# EAGLE design logger100 (EAGLE 6.4)
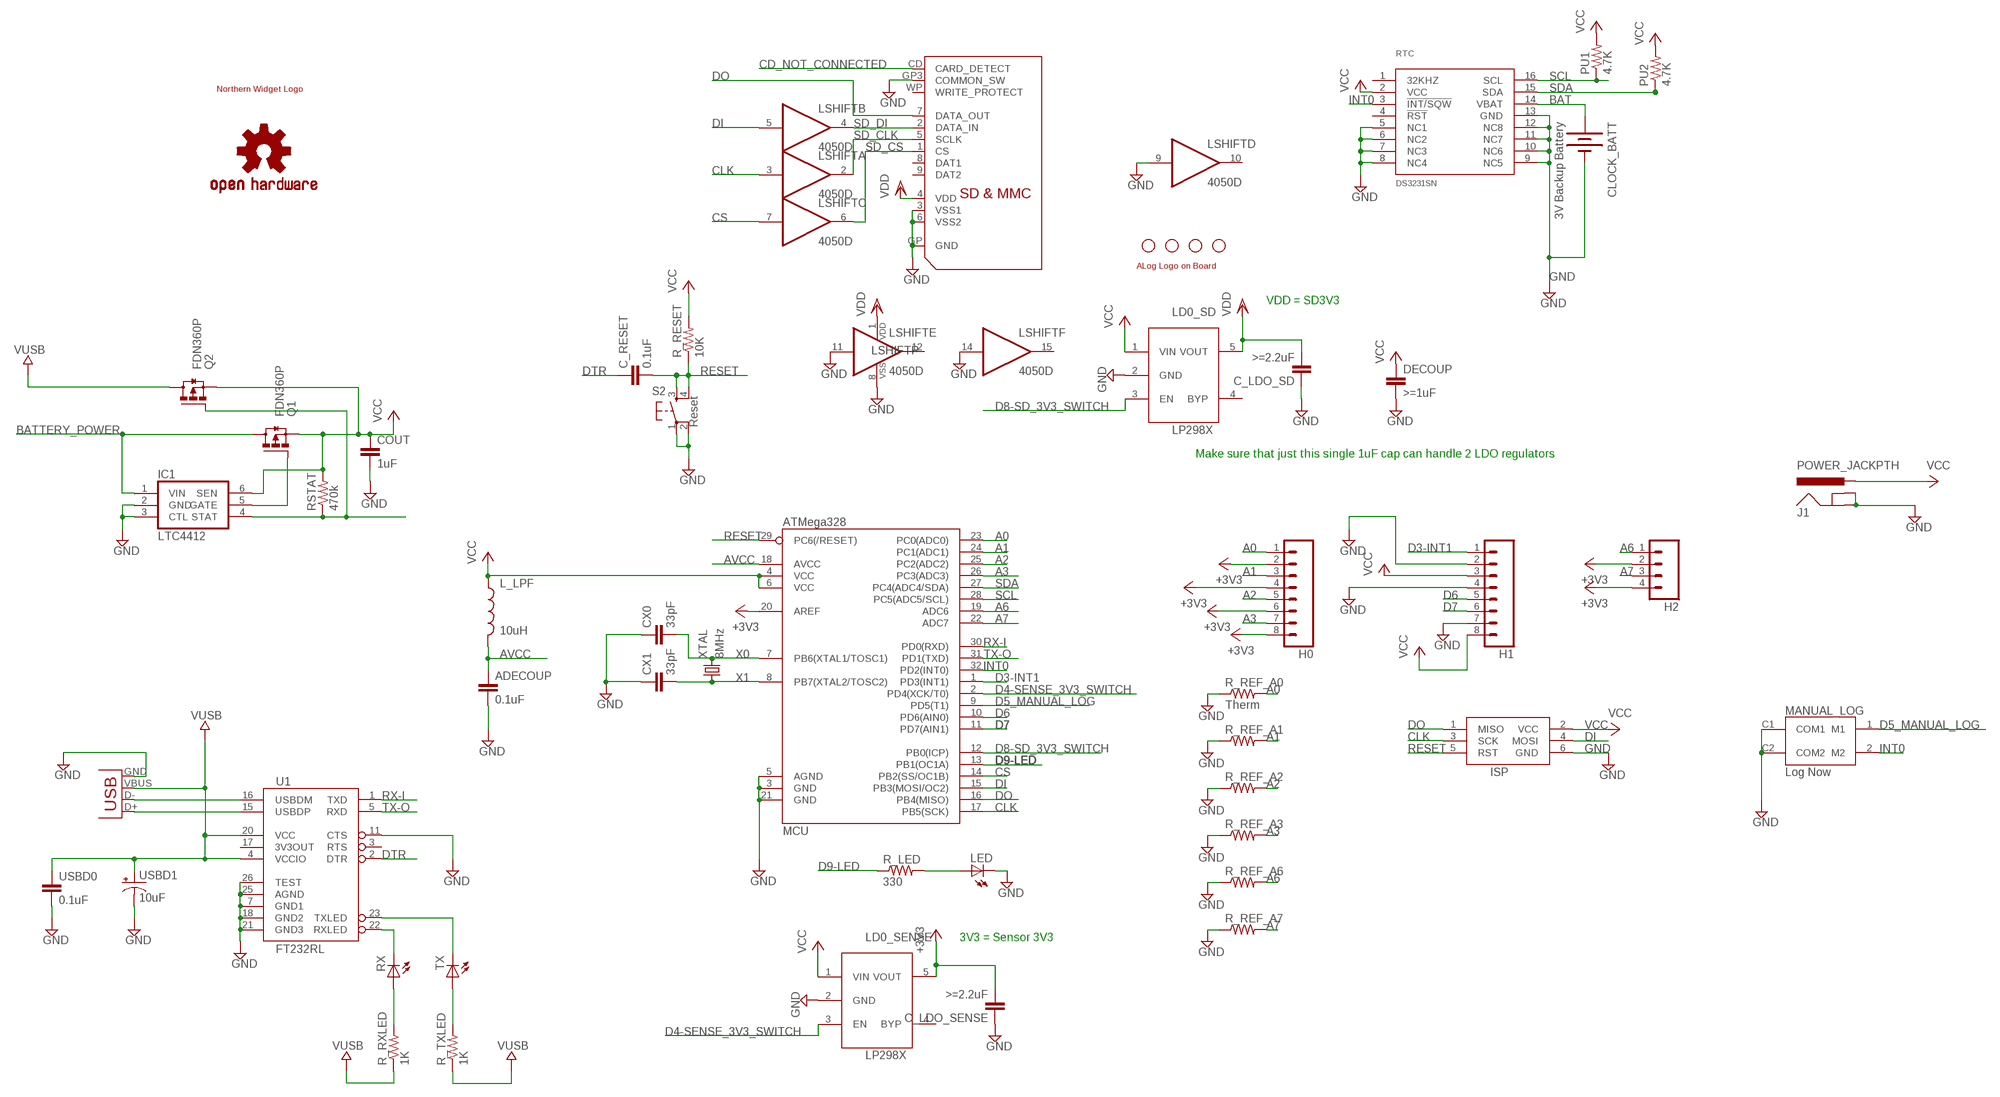
[diagram p0: schematic, sheet 1]

## Parts
ADECOUP  0.1uF  C-EUC0603  [C0603]
C_LDO_SD  >=2.2uF  C-EUC0603  [C0603]
C_LDO_SENSE  >=2.2uF  C-EUC0603  [C0603]
C_RESET  0.1uF  C-EUC0603  [C0603]
CLOCK_BATT  3V Backup Battery  BATTERY12PTH  [BATTCON_12MM_PTH]
COUT  1uF  C-EUC0603  [C0603-ROUND]
CX0  33pF  C-EUC0603  [C0603]
CX1  33pF  C-EUC0603  [C0603]
DECOUP  >=1uF  C-EUC0603  [C0603]
H0  M083.5MM-8  [SCREWTERMINAL-3.5MM-8]
H1  M083.5MM-8  [SCREWTERMINAL-3.5MM-8]
H2  M04SCREW  [SCREWTERMINAL-3.5MM-4]
IC1  LTC4412  LTC4412ES6  [TSOT23-6]
ISP  AVRISP-6  [AVRISP]
J1  POWER_JACKPTH  [POWER_JACK_PTH]
JP1  STAND-OFF  [STAND-OFF]
JP2  STAND-OFF  [STAND-OFF]
JP3  STAND-OFF  [STAND-OFF]
JP4  STAND-OFF  [STAND-OFF]
JP5  USB-B  USBPTH  [USB-B-PTH]
L_LPF  10uH  INDUCTOR0805  [0805]
LD0_SD  LP2985  LP298XS  [SOT23-5L]
LD0_SENSE  LP2985  LP298XS  [SOT23-5L]
LED  LED3MM  [LED3MM]
LOGO1  OSHW-LOGOM  [OSHW-LOGO-M]
LSHIFT  4050D  [SO16]
MANUAL_LOG  Log Now  TL3350'TL3350'  [TL_BUTTON]
MCU  ATMega328  ATMEGA168  [TQFP32-08]
PU1  4.7K  R-US_R0603  [R0603]
PU2  4.7K  R-US_R0603  [R0603]
Q1  FDN360P  [SUPER-SOT3]
Q2  FDN360P  [SUPER-SOT3]
R_LED  330  R-US_R0603  [R0603]
R_REF_A0  Therm  R-US_0207/10  [0207/10]
R_REF_A1  R-US_0207/10  [0207/10]
R_REF_A2  R-US_0207/10  [0207/10]
R_REF_A3  R-US_0207/10  [0207/10]
R_REF_A6  R-US_0207/10  [0207/10]
R_REF_A7  R-US_0207/10  [0207/10]
R_RESET  10K  R-US_R0603  [R0603]
R_RXLED  1K  R-US_R0603  [R0603]
R_TXLED  1K  R-US_R0603  [R0603]
RSTAT  470k  R-US_R0603  [R0603]
RTC  DS3231SN  [SO16W]
RX  LED0603  [LED-0603]
S2  Reset  TAC_SWITCHSND  [TACTILE_SWITCH_SMD]
SD  SDMMC06132  [06132]
TX  LED0603  [LED-0603]
U1  FT232RL  FT232RL-BASICSSOP  [SSOP28DB]
U$1  NWLOGO  [NWLOGO]
U$2  ALOG_LOGO_V1_5.5MM  [ALOG_LOGO_V1_SMALL]
USBD0  0.1uF  C-EUC0603  [C0603]
USBD1  10uF  CAP_POL1206  [EIA3216]
XTAL  8MHz  CRYSTALHC49UV  [HC49U-V]

## Nets
+3V3: C_LDO_SENSE.2 H0.2 H0.4 H0.6 H0.8 H2.2 H2.4 LD0_SENSE.5(VOUT) MCU.20(AREF)
A0: H0.1 MCU.23(PC0(ADC0)) R_REF_A0.2
A1: H0.3 MCU.24(PC1(ADC1)) R_REF_A1.2
A2: H0.5 MCU.25(PC2(ADC2)) R_REF_A2.2
A3: H0.7 MCU.26(PC3(ADC3)) R_REF_A3.2
A6: H2.1 MCU.19(ADC6) R_REF_A6.2
A7: H2.3 MCU.22(ADC7) R_REF_A7.2
AVCC: ADECOUP.1 L_LPF.2 MCU.18(AVCC)
BAT: CLOCK_BATT.VCC@1(+) RTC.14(VBAT)
BATTERY_POWER: IC1.1(VIN) Q1.3(D)
CD_NOT_CONNECTED: SD.CD(CARD_DETECT)
CLK: ISP.3(SCK) LSHIFT.3(A:I) MCU.17(PB5(SCK))
CS: LSHIFT.7(C:I) MCU.14(PB2(SS/OC1B))
D3-INT1: H1.1 MCU.1(PD3(INT1))
D4-SENSE_3V3_SWITCH: LD0_SENSE.3(EN) MCU.2(PD4(XCK/T0))
D5_MANUAL_LOG: MANUAL_LOG.1(M1) MCU.9(PD5(T1))
D6: H1.5 MCU.10(PD6(AIN0))
D7: H1.6 MCU.11(PD7(AIN1))
D8-SD_3V3_SWITCH: LD0_SD.3(EN) MCU.12(PB0(ICP))
D9-LED: MCU.13(PB1(OC1A)) R_LED.1
DI: ISP.4(MOSI) LSHIFT.5(B:I) MCU.15(PB3(MOSI/OC2))
DO: ISP.1(MISO) MCU.16(PB4(MISO)) SD.7(DATA_OUT)
DTR: C_RESET.1 U1.2(DTR)
GND: ADECOUP.2 C_LDO_SD.1 C_LDO_SENSE.1 CLOCK_BATT.GND(-) COUT.2 CX0.1 CX1.1 DECOUP.2 H1.2 H1.4 H1.7 IC1.2(GND) IC1.3(CTL) ISP.6(GND) J1.GND J1.GNDBREAK JP5.GND LD0_SD.2(GND) LD0_SENSE.2(GND) LED.K(C) LSHIFT.8(P:VSS) LSHIFT.9(D:I) LSHIFT.11(E:I) LSHIFT.14(F:I) MANUAL_LOG.C1(COM1) MANUAL_LOG.C2(COM2) MCU.3(GND) MCU.5(AGND) MCU.21(GND) R_REF_A0.1 R_REF_A1.1 R_REF_A2.1 R_REF_A3.1 R_REF_A6.1 R_REF_A7.1 RTC.5(NC1) RTC.6(NC2) RTC.7(NC3) RTC.8(NC4) RTC.9(NC5) RTC.10(NC6) RTC.11(NC7) RTC.12(NC8) RTC.13(GND) S2.1 S2.2 SD.3(VSS1) SD.6(VSS2) SD.GP3(COMMON_SW) SD.GP(GND) U1.7(GND1) U1.11(CTS) U1.18(GND2) U1.21(GND3) U1.25(AGND) U1.26(TEST) USBD0.2 USBD1.C(-)
INT0: MANUAL_LOG.2(M2) MCU.32(PD2(INT0)) RTC.3(!INT/SQW)
LED+: LED.A R_LED.2
N$1: RX.C U1.22(RXLED)
N$2: JP5.D+ U1.15(USBDP)
N$3: JP5.D- U1.16(USBDM)
N$4: TX.C U1.23(TXLED)
N$5: R_RXLED.2 RX.A
N$6: R_TXLED.2 TX.A
N$7: IC1.4(STAT) Q2.1(G) RSTAT.1
N$8: IC1.5(GATE) Q1.1(G)
RESET: C_RESET.2 ISP.5(RST) MCU.29(PC6(/RESET)) R_RESET.1 S2.3 S2.4
RX-I: MCU.30(PD0(RXD)) U1.1(TXD)
SCL: MCU.28(PC5(ADC5/SCL)) PU1.1 RTC.16(SCL)
SD_CLK: LSHIFT.2(A:O) SD.5(SCLK)
SD_CS: LSHIFT.6(C:O) SD.1(CS)
SD_DI: LSHIFT.4(B:O) SD.2(DATA_IN)
SDA: MCU.27(PC4(ADC4/SDA)) PU2.1 RTC.15(SDA)
TX-O: MCU.31(PD1(TXD)) U1.5(RXD)
VCC: COUT.1 DECOUP.1 H1.3 H1.8 IC1.6(SEN) ISP.2(VCC) J1.PWR L_LPF.1 LD0_SD.1(VIN) LD0_SENSE.1(VIN) MCU.4(VCC) MCU.6(VCC) PU1.2 PU2.2 Q1.2(S) Q2.2(S) R_RESET.2 RSTAT.2 RTC.2(VCC)
VDD: C_LDO_SD.2 LD0_SD.5(VOUT) LSHIFT.1(P:VDD) SD.4(VDD)
VUSB: JP5.VBUS Q2.3(D) R_RXLED.1 R_TXLED.1 U1.4(VCCIO) U1.20(VCC) USBD0.1 USBD1.A(+)
X0: CX0.2 MCU.7(PB6(XTAL1/TOSC1)) XTAL.2
X1: CX1.2 MCU.8(PB7(XTAL2/TOSC2)) XTAL.1
Unconnected: LD0_SD.4(BYP) LD0_SENSE.4(BYP) LSHIFT.10(D:O) LSHIFT.12(E:O) LSHIFT.15(F:O) RTC.1(32KHZ) RTC.4(!RST) SD.8(DAT1) SD.9(DAT2) SD.WP(WRITE_PROTECT) U1.3(RTS) U1.17(3V3OUT)

## Notes on the sheet
- VDD = SD3V3
- Make sure that just this single 1uF cap can handle 2 LDO regulators
- 3V3 = Sensor 3V3

## Library data of the parts
ADECOUP C_LDO_SD C_LDO_SENSE C_RESET CX0 CX1 DECOUP USBD0 = resistor:C-EU: CAPACITOR, European symbol
CLOCK_BATT = SparkFun:BATTERY: Battery Holders Various common sizes : AA, AAA, 20mm coin cell and 12mm coin cell.
COUT = SmartPrj:C-EU: CAPACITOR, European symbol
H0 H1 = SparkFun:M08: Header 8 Standard 8-pin 0.1" header. Use with straight break away headers (SKU : PRT-00116), right angle break away headers (PRT-00553), swiss pins (PRT-00743), machine pins (PRT-00117), and female headers (PRT-00115).
H2 = SparkFun:M04: Header 4 Standard 4-pin 0.1" header. Use with straight break away headers (SKU : PRT-00116), right angle break away headers (PRT-00553), swiss pins (PRT-00743), machine pins (PRT-00117), and female headers (PRT-00115). Molex polarized connector foot print use with SKU : PRT-08231 with associated crimp pins and housings. 1MM SMD Version SKU: PRT-10208
IC1 = awickert:LTC4412*: Low Loss PowerPath Controller
ISP = adafruit:AVRISP: AVR ISP HEADER Standard 6 pin header for AVR programming
J1 = SparkFun:POWER_JACK: Power Jack This is the standard 5.5mm barrel jack for power. The PTH is the most common, proven, reliable, footprint. All others are experimental. The Slot footprint only works if the mill layer is transmitted to the PCB fab house so be warned. Spark Fun Electronics SKU : PRT-00119. Mating wall wart : TOL-00298 (and others)
JP1-JP4 = SparkFun:STAND-OFF: Stand Off This is the mechanical footprint for a #4 phillips button head screw. Use the keepout ring to avoid running the screw head into surrounding components. SKU : PRT-00447
JP5 = SparkFun-Connectors:USB: USB Connectors USB-B-PTH is fully proven SKU : PRT-00139/CONN-08278 USB-miniB is fully proven SKU : PRT-00587 USB-A-PCB is untested. USB-A-H is throughly reviewed, but untested. Spark Fun Electronics SKU : PRT-00437 USB-B-SMT is throughly reviewed, but untested. Needs silkscreen touching up. USB-A-S has not been used/tested USB-MB-H has not been used/tested USB-MICROB has been used. CONN-09505; PROD_ID: CONN-08278
L_LPF = SparkFun:INDUCTOR: Inductors Basic Inductor/Choke - 0603 and 1206. Footprints are not proven and vary greatly between part numbers.
LD0_SD LD0_SENSE = adafruit:LP298X
LED = SparkFun:LED: LEDs Standard schematic elements and footprints for 5mm, 3mm, 1206, and 0603 sized LEDs. 5mm - Spark Fun Electronics SKU : COM-00529 (and others)
LOGO1 = SparkFun-Aesthetics:OSHW-LOGO: Open Source Hardware Logo This logo indicates the piece of hardware it is found on incorporates a OSHW license and/or adheres to the definition of open source hardware found here: http://freedomdefined.org/OSHW
LSHIFT = 40xx:4050: Hex non-inverting BUFFER
MANUAL_LOG = awickert:TL3350: Dual action (half- and full-press) button: COM1 and COM2 are connected internally. Pin 1 connects to COM1 on a half-press, and both connect on a full press.
MCU = SparkFun:ATMEGA168
PU1 PU2 R_LED R_RESET R_RXLED R_TXLED RSTAT = rcl:R-US_: RESISTOR, American symbol
Q1 Q2 = transistor-power:FDN360P: Single P-Channel, PowerTrench (R) MOSFET Source: http://www.fairchildsemi.com/ds/FD/FDN360P.pdf
R_REF_A0 R_REF_A1-R_REF_A3 R_REF_A6 R_REF_A7 = resistor:R-US_: RESISTOR, American symbol
RTC = comfile:DS3231SN
RX TX = SparkFun-LED:LED: LEDs Standard schematic elements and footprints for 5mm, 3mm, 1206, and 0603 sized LEDs. 5mm - Spark Fun Electronics SKU : COM-00529 (and others)
S2 = SparkFun:TAC_SWITCH: Momentary Switch Button commonly used for reset or general input. Spark Fun Electronics SKU : COM-00097
SD = adafruit:SDMMC: SD MMC Card holder 4UCON part #06132 - easy to solder
U1 = SparkFun-DigitalIC:FT232RL-BASIC: USB UART This is the simplified version of the FT232RL unit. Only what you need, nothing you don't. Spark Fun Electronics SKU : COM-00650
U$1 = awickert:NWLOGO
U$2 = awickert:ALOG_LOGO_V1_5.5MM
USBD1 = SparkFun:CAP_POL: Capacitor Polarized These are standard SMD and PTH capacitors. Normally 10uF, 47uF, and 100uF in electrolytic and tantalum varieties. Always verify the external diameter of the through hole cap, it varies with capacity, voltage, and manufacturer. The EIA devices should be standard.
XTAL = SparkFun:CRYSTAL: Crystals Various standard crystals. Proven footprints. Spark Fun Electronics SKU : COM-00534

## Net classes
1 power: width 0.254 mm

## Board
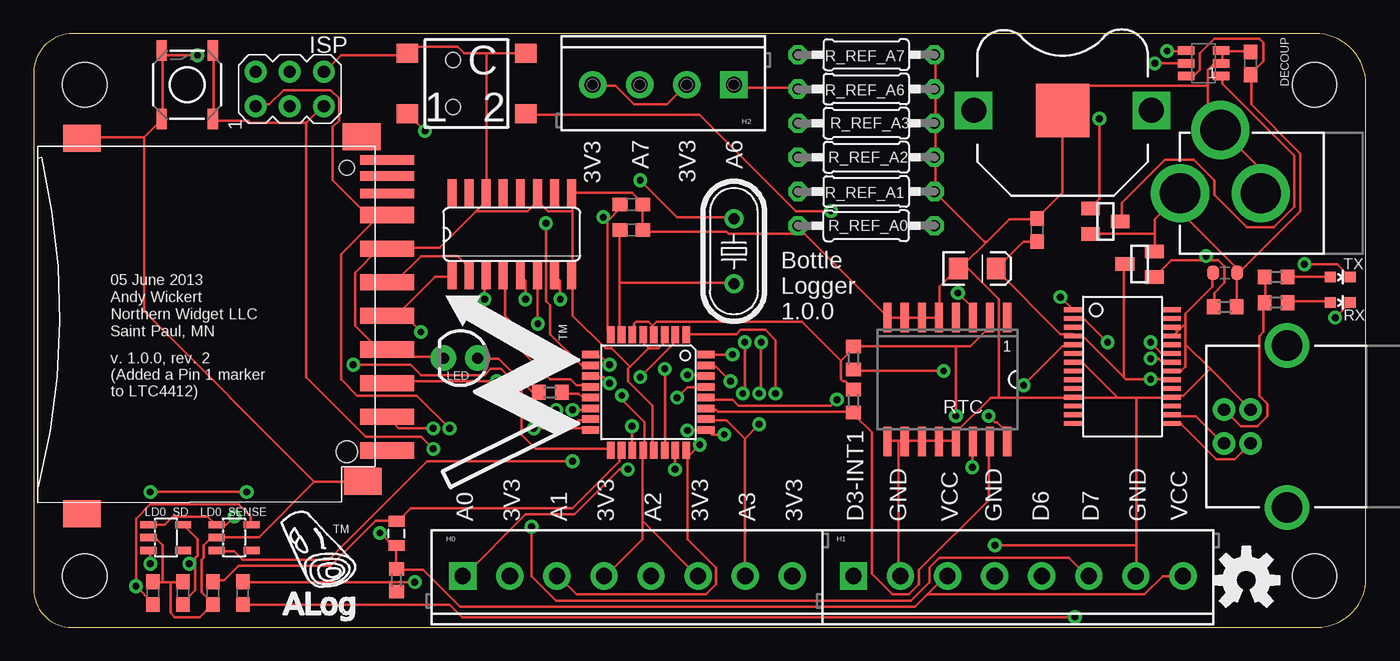
[diagram p1: board, top side]
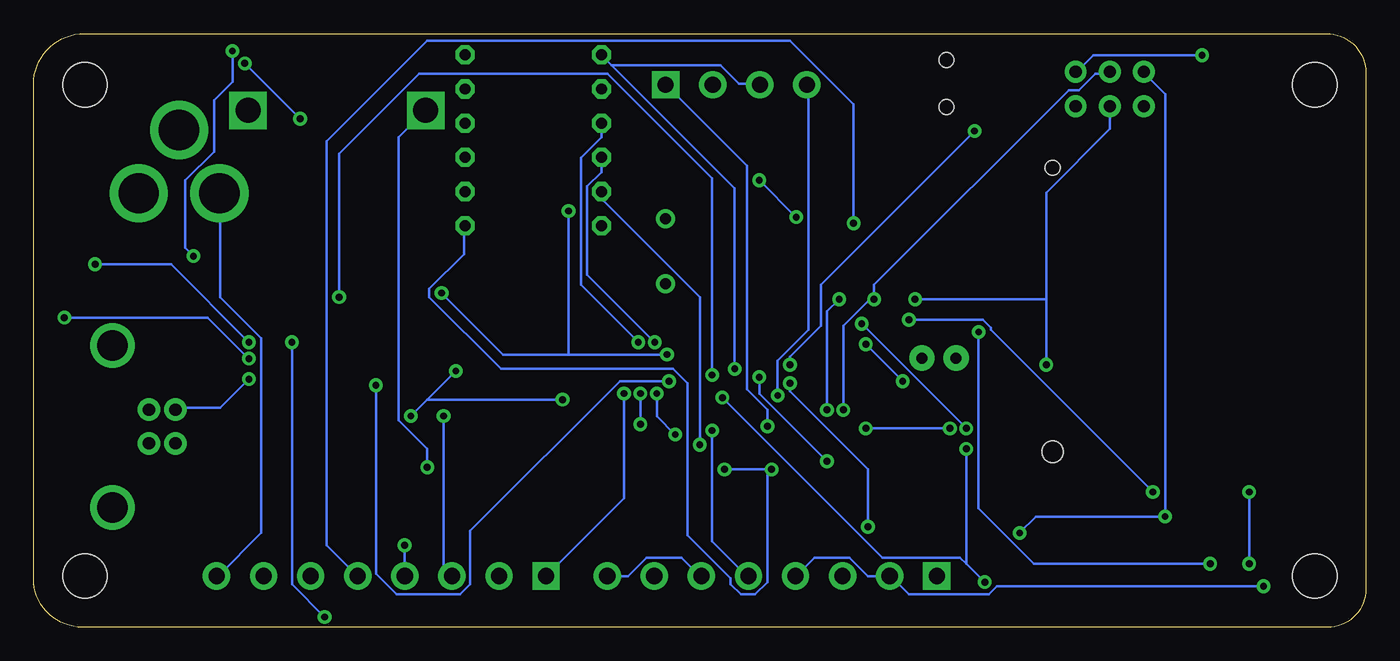
[diagram p2: board, bottom side, seen from below]

Size 99.05 x 44.12 mm. Coordinates in mm from the lower left corner, seen from the top.
Outline: 99.05,40.36 arc90 95.29,44.12 2.91,44.12 arc90 0,41.21 0,2.85 arc90 2.85,0 95.43,0 arc90 99.05,3.62 99.05,40.36
Copper layers (1*16): Top 0.035mm / dielectric 1.5mm / Bottom 0.035mm
Design rules "SparkFun": minimum track width 8mil, minimum drill 20mil, track to track 8mil, track to pad 8mil, pad to pad 8mil, via to via 8mil, smd to smd 8mil, copper to edge 10mil, drill to drill 8mil, minimum pad ring 12mil, minimum via ring 10mil, stop-mask expansion 4mil, vias tented up to drill 25mil, thermal gap 10mil

### Footprints (pad centres in the part's own frame; a part is rotated, then mirrored left to right if it is on the bottom)
C0603 = smd 1.1 x 1: 1 -0.85,0; 2 0.85,0
BATTCON_12MM_PTH = smd 3.962 x 3.962: GND 0,0 | drill 1.854 square: VCC@1 -6.604,0; VCC@2 6.604,0
C0603-ROUND = smd 0.898 x 1.1: 1 -0.889,0; 2 0.889,0
SCREWTERMINAL-3.5MM-8 = drill 1.2 pad 2.032 square: 1 0,0 | drill 1.2 pad 2.032: 2 3.5,0; 3 7,0; 4 10.5,0; 5 14,0; 6 17.5,0; 7 21,0; 8 24.5,0
SCREWTERMINAL-3.5MM-4 = drill 1.2 pad 2.032 square: 1 0,0 | drill 1.2 pad 2.032: 2 3.5,0; 3 7,0; 4 10.5,0
TSOT23-6 = smd 0.622 x 1.22: 1 -0.95,-1.31; 2 0,-1.31; 3 0.95,-1.31; 4 0.95,1.31; 5 0,1.31; 6 -0.95,1.31
AVRISP = drill 0.9 pad 1.626: 1 -1.27,2.54; 2 1.27,2.54; 3 -1.27,0; 4 1.27,0; 5 -1.27,-2.54; 6 1.27,-2.54
POWER_JACK_PTH = drill 2.997 pad 4.318: GND 0,7.7; GNDBREAK 4.7,10.7; PWR 0,13.7
STAND-OFF = hole 3.302: 0,0
USB-B-PTH = drill 0.914 pad 1.676: D+ 0,1.25; D- 1.981,1.25; GND 0,-1.25; VBUS 1.981,-1.25 | drill 2.286: S1 -2.718,-6.02; S2 -2.718,6.02
0805 = smd 0.8 x 1.2: 1 -0.9,0; 2 0.9,0
SOT23-5L = smd 0.55 x 1.2: 1 -0.95,-1.3; 2 0,-1.3; 3 0.95,-1.3; 4 0.95,1.3; 5 -0.95,1.3
LED3MM = drill 0.813 pad 1.88: A -1.27,0; K 1.27,0
SO16 = smd 0.66 x 2.032: 1 -4.445,-3.073; 2 -3.175,-3.073; 3 -1.905,-3.073; 4 -0.635,-3.073; 5 0.635,-3.073; 6 1.905,-3.073; 7 3.175,-3.073; 8 4.445,-3.073; 9 4.445,3.073; 10 3.175,3.073; 11 1.905,3.073; 12 0.635,3.073; 13 -0.635,3.073; 14 -1.905,3.073; 15 -3.175,3.073; 16 -4.445,3.073
TL_BUTTON = smd 1.6 x 1.4: 1 0.8,0.7; 2 9.6,0.7; C1 0.8,5.2; C2 9.6,5.2 | hole 1.1: 4.2,1.2; 4.2,4.7
TQFP32-08 = smd 1.27 x 0.559: 1 -4.293,2.8; 2 -4.293,2; 3 -4.293,1.2; 4 -4.293,0.4; 5 -4.293,-0.4; 6 -4.293,-1.2; 7 -4.293,-2; 8 -4.293,-2.8; 17 4.293,-2.8; 18 4.293,-2; 19 4.293,-1.2; 20 4.293,-0.4; 21 4.293,0.4; 22 4.293,1.2; 23 4.293,2; 24 4.293,2.8 | smd 0.559 x 1.27: 9 -2.8,-4.293; 10 -2,-4.293; 11 -1.2,-4.293; 12 -0.4,-4.293; 13 0.4,-4.293; 14 1.2,-4.293; 15 2,-4.293; 16 2.8,-4.293; 25 2.8,4.293; 26 2,4.293; 27 1.2,4.293; 28 0.4,4.293; 29 -0.4,4.293; 30 -1.2,4.293; 31 -2,4.293; 32 -2.8,4.293
R0603 = smd 1 x 1.1: 1 -0.85,0; 2 0.85,0
SUPER-SOT3 = smd 1 x 1.4: 1 -0.95,-1.1; 2 0.95,-1.1; 3 0,1.1
0207/10 = drill 0.813 octagon: 1 -5.08,0; 2 5.08,0
SO16W = smd 0.6 x 2.2: 1 -4.445,-4.6; 2 -3.175,-4.6; 3 -1.905,-4.6; 4 -0.635,-4.6; 5 0.635,-4.6; 6 1.905,-4.6; 7 3.175,-4.6; 8 4.445,-4.6; 9 4.445,4.6; 10 3.175,4.6; 11 1.905,4.6; 12 0.635,4.6; 13 -0.635,4.6; 14 -1.905,4.6; 15 -3.175,4.6; 16 -4.445,4.6
LED-0603 = smd 0.8 x 0.8: A 0,-0.75; C 0,0.75
TACTILE_SWITCH_SMD = smd 1.524 x 0.762: 1 -2.54,1.905; 2 2.54,1.905; 3 -2.54,-1.905; 4 2.54,-1.905
06132 = smd 1.2 x 4: 1 6.9,0.9; 2 4.4,0.9; 3 1.9,0.9; 4 -0.6,0.9; 5 -3.1,0.9; 6 -5.6,0.9; 7 -8.1,0.9; 9 9.4,0.9 | smd 0.7 x 4: 8 -9.7,0.9; CD -11,0.9; WP -12.2,0.9 | smd 2 x 2.8: GP -13.8,-21.8; GP2 14.1,-21.8; GP3 11.7,-0.9; GP4 -13.9,-1 | hole 1.1: -11.6,-2.1 | hole 1.6: 9.5,-2.1
SSOP28DB = smd 0.348 x 1.397: 1 -4.225,-3.656; 2 -3.575,-3.656; 3 -2.925,-3.656; 4 -2.275,-3.656; 5 -1.625,-3.656; 6 -0.975,-3.656; 7 -0.325,-3.656; 8 0.325,-3.656; 9 0.975,-3.656; 10 1.625,-3.656; 11 2.275,-3.656; 12 2.925,-3.656; 13 3.575,-3.656; 14 4.225,-3.656; 15 4.225,3.656; 16 3.575,3.656; 17 2.925,3.656; 18 2.275,3.656; 19 1.625,3.656; 20 0.975,3.656; 21 0.325,3.656; 22 -0.325,3.656; 23 -0.975,3.656; 24 -1.625,3.656; 25 -2.275,3.656; 26 -2.925,3.656; 27 -3.575,3.656; 28 -4.225,3.656
EIA3216 = smd 1.4 x 1.6: A 1.4,0; C -1.4,0
HC49U-V = drill 0.813: 1 -2.413,0; 2 2.413,0

### Placement (x,y rotation side)
ADECOUP  13.33,2.54 270 top
C_LDO_SD  11.1,2.54 270 top
C_LDO_SENSE  8.88,2.54 270 top
C_RESET  15.55,2.54 90 top
CLOCK_BATT  76.51,38.42 0 top
COUT  88.57,26.35 180 top
CX0  44.44,29.53 180 top
CX1  44.44,31.43 180 top
DECOUP  90.48,41.91 90 top
H0  31.9,3.81 0 top
H1  60.95,3.81 0 top
H2  52.06,40.32 180 top
IC1  86.98,41.91 90 top
ISP  19.04,40.01 90 top
J1  98.94,32.26 90 top
JP1  3.8,3.81 0 top
JP2  95.24,40.32 90 top
JP3  95.24,3.81 90 top
JP4  3.8,40.32 0 top
JP5  90.48,14.92 180 top
L_LPF  26.98,6.99 90 top
LD0_SD  9.83,6.67 270 top
LD0_SENSE  14.91,6.67 270 top
LED  31.74,20 180 top
LOGO1  90.16,3.49 0 top
LSHIFT  35.55,29.21 0 top
MANUAL_LOG  26.98,37.47 0 top
MCU  45.71,17.46 270 top
PU1  60.95,20 90 top
PU2  60.95,16.83 90 top
Q1  79.68,30.16 270 top
Q2  82.22,26.99 90 top
R_LED  38.41,17.46 180 top
R_REF_A0  61.9,29.84 0 top
R_REF_A1  61.9,32.38 180 top
R_REF_A2  61.9,34.92 180 top
R_REF_A3  61.9,37.47 180 top
R_REF_A6  61.9,40.01 180 top
R_REF_A7  61.9,42.55 180 top
R_RESET  26.98,3.49 90 top
R_RXLED  92.38,24.13 0 top
R_TXLED  92.38,26.04 0 top
RSTAT  88.57,23.81 0 top
RTC  67.93,18.41 180 top
RX  97.14,24.13 270 top
S2  11.42,40.32 90 top
SD  25.39,22.54 270 top
TX  97.14,26.04 270 top
U1  80.95,19.37 270 top
U$1  35.87,17.46 90 top
U$2  21.26,5.71 0 top
USBD0  74.6,29.53 90 top
USBD1  70.16,26.67 0 top
XTAL  52.06,27.94 270 top

### Tracks (layer width: path | path; a pad name or v marks a point on that pad's centre or on a via)
+3V3  (via drill 0.51)
  Top 0.203: H2.4 41.59,40.23 43.27,40.23 44.64,38.86 47.08,38.86 48.45,40.23 H2.2 | C_LDO_SENSE.2 8.83,1.83 v7.61,3.05 7.61,8.08 8.68,9.14 15.23,9.14 16.14,8.23 16.14,7.62 LD0_SENSE.5 | 45.25,7.92 45.25,6.55 42.51,3.81 H0.4 | 45.25,7.92 45.25,13.11 MCU.20 45.41,13.26 45.41,15.24 43.73,16.92 v43.73,17.22 | 45.25,7.92 49.37,3.81 H0.6
  Bottom 0.203: H0.4 42.36,3.81 40.99,5.18 38.4,5.18 37.02,3.81 H0.2 35.35,3.81 33.98,2.44 28.03,2.44 27.42,3.05 v7.61,3.05 | H0.8 54.85,3.81 53.48,5.18 50.89,5.18 49.52,3.81 H0.6 | v43.73,17.22 43.73,19.81 41.44,22.1 41.44,40.23 H2.4
A0  (via drill 0.51)
  Top 0.203: v47.69,11.73 47.69,13.11 MCU.23 | v44.19,11.73 43.58,11.73 40.22,8.38 36.57,8.38 31.99,3.81 H0.1
  Bottom 0.203: 44.49,11.73 v47.69,11.73 | 44.49,11.73 44.49,3.35 45.41,2.44 46.47,2.44 47.23,3.2 47.23,3.66 50.43,6.86 50.43,18.14 51.5,19.2 64.3,19.2 69.64,24.54 69.64,25.15 67.05,27.74 67.05,29.72 R_REF_A0.2 | 44.49,11.73 v44.19,11.73
A1  (via drill 0.51)
  Top 0.203: 48.61,12.65 48.61,6.55 50.74,4.42 50.74,3.2 49.98,2.44 40.38,2.44 39,3.81 H0.3 | 48.61,12.65 48.61,13.11 MCU.24 48.61,12.65 | 48.61,12.65 v49.52,13.56
  Bottom 0.203: v49.52,13.56 49.52,24.54 56.68,31.7 56.68,32.31 R_REF_A1.2
A2  (via drill 0.51)
  Top 0.203: v48.61,14.63 49.98,14.63 MCU.25 50.13,14.63 50.43,14.33 v51.35,14.33 | v52.87,21.18 52.87,17.53 v52.72,17.37
  Bottom 0.203: v48.61,14.63 48.61,6.4 46.02,3.81 H0.5 | v52.87,21.18 57.9,26.21 57.9,32.77 56.84,33.83 56.84,34.9 R_REF_A2.2 | v52.72,17.37 52.72,15.7 v51.35,14.33
A3  (via drill 0.51)
  Top 0.203: 52.87,14.02 51.5,15.39 50.13,15.39 MCU.26 | 52.87,14.02 52.87,3.81 H0.7 | v54.09,21.18 54.09,17.53 v53.94,17.37 | 52.87,14.02 v53.94,15.09
  Bottom 0.203: v54.09,21.18 58.36,25.45 58.36,34.9 56.84,36.42 56.84,37.34 R_REF_A3.2 | v53.94,15.09 v53.94,17.37
A6  (via drill 0.51)
  Top 0.203: v44.49,14.94 44.49,13.26 MCU.19 | R_REF_A6.2 56.68,40.08 52.26,40.08 52.11,40.23 H2.1
  Bottom 0.203: v44.49,14.94 44.49,16.15 46.02,17.68 46.02,34.29 51.96,40.23 H2.1
A7  (via drill 0.51)
  Top 0.203: v46.93,19.2 46.93,13.26 MCU.22
  Bottom 0.203: v46.93,19.2 46.93,32.61 56.07,41.76 | 56.07,41.76 56.84,42.52 R_REF_A7.2 | 56.07,41.76 48,41.76 46.62,40.39 45.1,40.39 H2.3
AVCC
  Top 0.203: ADECOUP.1 13.4,3.5 14.16,3.5 15.23,4.57 22.09,4.57 25.44,7.92 26.96,7.92 L_LPF.2 27.12,7.92 28.03,8.84 40.07,8.84 43.58,12.34 43.58,13.11 MCU.18
BAT  (via drill 0.51)
  Top 0.203: v69.79,11.89 69.79,13.72 RTC.14
  Bottom 0.203: v69.79,11.89 69.79,13.26 71.92,15.39 71.92,36.42 69.94,38.41 CLOCK_BATT.VCC@1
BATTERY_POWER
  Top 0.203: IC1.1 88.38,40.84 88.38,40.39 93.72,35.05 93.72,31.24 92.19,29.72 90.21,29.72 87.77,32.16 87.77,33.22 86.25,34.75 84.11,34.75 80.91,31.55 80.91,30.18 Q1.3
CLK  (via drill 0.51)
  Top 0.203: v23.76,19.51 28.03,19.51 28.79,18.75 33.52,18.75 33.98,19.2 34.74,19.2 36.26,17.68 36.26,14.33 37.33,13.26 42.81,13.26 MCU.17 | v33.52,24.38 33.52,26.06 LSHIFT.3
  Bottom 0.203: 23.76,24.38 23.76,32.31 19.04,37.03 ISP.3 | 23.76,24.38 v23.76,19.51 | 23.76,24.38 v33.52,24.38
CS  (via drill 0.51)
  Top 0.203: v40.07,16.15 41.29,16.15 MCU.14 | v39.16,24.38 39.16,25.76 38.85,26.06 LSHIFT.7
  Bottom 0.203: v40.07,16.15 40.07,23.47 v39.16,24.38
D3-INT1  (via drill 0.51)
  Top 0.203: v55.16,17.37 55.16,21.34 54.4,22.1 52.57,22.1 52.26,21.79 48.61,21.79 MCU.1
  Bottom 0.203: v55.16,17.37 55.16,9.6 H1.1
D4-SENSE_3V3_SWITCH  (via drill 0.51)
  Top 0.203: v40.07,12.34 29.25,12.34 21.94,5.03 15.54,5.03 14.93,5.64 13.71,5.64 LD0_SENSE.3 | v45.1,18.59 47.69,21.18 47.69,21.64 MCU.2
  Bottom 0.203: v40.07,12.34 45.1,17.37 v45.1,18.59
D5_MANUAL_LOG  (via drill 0.51)
  Top 0.203: v42.81,19.51 42.21,20.12 41.44,20.12 MCU.9 | v29.1,36.88 27.88,38.1 MANUAL_LOG.1
  Bottom 0.203: v42.81,19.51 42.81,20.12 40.53,22.4 40.53,25.45 v29.1,36.88
D6  (via drill 0.51)
  Top 0.203: v38.09,30.02 38.09,24.23 38.4,23.93 38.4,21.79 40.68,19.51 41.29,19.51 MCU.10
  Bottom 0.203: v38.09,30.02 38.09,38.86 42.81,43.59 69.79,43.59 77.26,36.12 77.26,6.1 74.97,3.81 H1.5
D7  (via drill 0.51)
  Top 0.203: v42.81,18.14 42.36,18.59 41.44,18.59 MCU.11 | v37.02,7.47 37.02,3.81 38.85,1.98 65.22,1.98 66.59,3.35 66.59,4.42 67.35,5.18 76.95,5.18 78.32,3.81 H1.6
  Bottom 0.203: v42.81,18.14 42.81,17.53 37.02,11.73 v37.02,7.47
D8-SD_3V3_SWITCH  (via drill 0.51)
  Top 0.203: v8.68,4.72 8.68,5.64 LD0_SD.3 | v15.84,10.06 v8.68,10.06 | v33.98,22.86 38.4,18.44 39.92,18.44 40.38,17.98 41.29,17.98 MCU.12
  Bottom 0.203: v8.68,10.06 v8.68,4.72 | v15.84,10.06 27.88,22.1 27.88,22.25 28.49,22.86 v33.98,22.86
D9-LED
  Top 0.203: R_LED.1 39.31,17.37 40.53,17.37 40.83,17.07 41.29,17.07 MCU.13
DI  (via drill 0.51)
  Top 0.203: v38.85,16.15 39.77,15.24 40.38,15.24 40.53,15.39 41.29,15.39 MCU.15 | v36.57,24.38 36.57,25.76 LSHIFT.5
  Bottom 0.203: v38.85,16.15 38.85,22.4 36.87,24.38 v36.57,24.38 36.57,25.45 22.09,39.93 21.33,39.93 20.11,41.15 19.04,41.15 ISP.4
DO  (via drill 0.51)
  Top 0.203: v37.18,14.78 41.29,14.78 MCU.16 | v30.93,14.78 28.49,17.22 24.07,17.22 22.85,18.44 22.85,27.74 25.29,30.18 | 25.29,30.18 25.75,30.63 26.2,30.63 SD.7 25.29,30.18 | 25.29,30.18 22.24,33.22 22.24,37.19 22.7,37.64 22.7,39.32 22.09,39.93 18.58,39.93 17.52,38.86 16.6,38.86 ISP.1
  Bottom 0.203: v30.93,14.78 v37.18,14.78
DTR  (via drill 0.51)
  Top 0.203: v77.41,0.76 31.84,0.76 30.93,1.68 15.69,1.68 C_RESET.1 | v79.85,21.18 78.17,22.86 77.41,22.86 U1.2
  Bottom 0.203: v77.41,0.76 79.85,3.2 v79.85,21.18
GND  (via drill 0.51)
  Top 0.203: 9.59,42.52 9.59,42.82 S2.2 9.59,42.52 | 9.59,42.52 9.59,37.8 S2.1 9.44,37.64 8.22,36.42 | 8.22,36.42 3.65,36.42 SD.GP | 10.2,3.35 10.96,3.35 C_LDO_SD.1 | 10.2,3.35 9.59,3.35 | 9.59,3.35 8.98,3.35 C_LDO_SENSE.1 | 9.59,3.35 9.59,6.1 9.13,6.55 8.68,6.55 LD0_SD.2 | 20.87,10.82 24.37,10.82 SD.GP3 | 20.87,10.82 16.75,6.71 13.71,6.71 LD0_SENSE.2 13.55,6.55 13.1,6.55 12.64,6.1 12.64,5.18 12.49,5.03 12.49,2.59 13.25,1.83 ADECOUP.2 13.25,1.68 12.33,0.76 10.51,0.76 10.2,1.07 10.2,3.35 | 8.22,36.42 8.22,23.47 20.87,10.82 | 45.71,20.73 45.41,21.03 45.41,21.64 MCU.5 | 45.71,20.73 46.47,20.73 46.78,21.03 46.78,21.64 MCU.3 | 45.71,20.73 44.34,19.36 | 44.34,19.36 44.19,19.2 44.19,18.29 46.02,16.46 46.02,13.26 MCU.21 | 40.07,30.94 40.07,32.16 LSHIFT.9 40.07,32.31 44.49,32.31 45.25,31.55 CX1.1 45.25,31.39 45.25,29.57 CX0.1 45.41,29.41 51.5,29.41 51.65,29.26 57.29,29.26 | 40.07,30.94 40.07,26.21 LSHIFT.8 40.07,26.06 40.07,23.16 42.51,20.73 42.97,20.73 44.34,19.36 | 37.48,31.7 37.48,32.16 LSHIFT.11 37.48,31.7 | 37.48,31.7 38.24,30.94 40.07,30.94 | LED.K 30.47,20.12 26.81,20.12 26.35,20.57 SD.3 26.2,20.73 25.59,20.73 23.92,22.4 23.92,26.36 25.59,28.04 26.2,28.04 SD.6 26.35,28.19 30.16,28.19 32.91,30.94 | ISP.6 21.63,41.3 22.85,42.52 27.73,42.52 MANUAL_LOG.C1 27.88,42.67 28.34,43.13 31.54,43.13 31.99,42.67 33.67,42.67 | 33.67,42.67 36.57,42.67 MANUAL_LOG.C2 | 33.67,42.67 33.67,32.31 LSHIFT.14 33.52,32.16 33.52,31.55 32.91,30.94 | 37.48,31.7 36.72,30.94 32.91,30.94 | 64.76,13.87 64.3,13.87 | 64.3,13.87 63.54,13.87 RTC.9 | 68.57,13.87 67.35,13.87 RTC.12 67.2,13.87 66.13,13.87 RTC.11 65.98,13.87 64.76,13.87
  Top 0.203: 64.76,13.87 RTC.10 | 64.3,13.87 64.3,3.81 H1.2 | 85.64,22.55 85.64,23.32 87.62,25.3 87.62,26.21 COUT.2 | 85.03,21.95 84.72,21.64 U1.25 | 85.03,21.95 85.64,22.55 | 85.64,22.55 85.64,21.03 | 85.64,21.03 85.64,19.36 85.33,19.05 84.72,19.05 U1.21 | 85.03,21.95 84.72,22.25 U1.26 | 85.64,21.03 87.47,19.2 | 87.47,19.2 90.36,16.31 JP5.GND | 81.98,17.07 84.57,17.07 U1.18 84.72,17.22 85.49,17.22 87.47,19.2 | 81.98,17.07 80.61,17.07 | 80.61,17.07 77.41,17.07 U1.11 77.26,17.07 71.77,17.07 | 80.61,17.07 78.02,19.66 77.41,19.66 U1.7 | 81.98,17.07 81.98,6.1 | 81.98,6.1 81.98,3.81 H1.7 | 68.57,13.87 68.57,14.48 71.16,17.07 71.77,17.07 | 68.57,13.87 RTC.13 | 88.38,42.82 90.36,42.82 DECOUP.2 | 88.38,42.82 88.38,41.91 IC1.2 87.77,41.91 87.31,41.45 87.31,40.23 | 88.38,42.82 IC1.3 | 87.31,40.23 87.31,37.95 88.23,37.03 J1.GNDBREAK 88.38,36.88 91.12,34.14 91.12,32.31 J1.GND | RTC.7 63.54,23.01 RTC.8 63.39,23.16 57.29,29.26 | RTC.7 65.98,23.01 RTC.6 66.13,23.01 67.2,23.01 RTC.5 67.35,23.16 67.35,25.3 68.72,26.67 USBD1.C | RTC.7 | 57.29,29.26 56.84,29.72 R_REF_A0.1 | R_REF_A7.1 67.05,42.52 67.05,40.08 R_REF_A6.1 67.05,39.93 67.05,37.49 R_REF_A3.1 67.05,37.34 67.05,35.05 R_REF_A2.1 67.05,34.9 67.05,32.46 R_REF_A1.1 67.05,32.31 70.7,28.65 70.86,28.65 | 69.18,26.98 68.88,26.67 USBD1.C | 69.18,26.98 70.86,28.65 | 70.86,28.65 72.53,30.33 74.51,30.33 USBD0.2 74.67,30.48 76.49,32.31 76.49,38.41 CLOCK_BATT.GND 78.32,40.23 87.31,40.23 | 71.77,17.07 71.77,24.38 69.18,26.98 | 69.18,26.98 USBD1.C | v12.18,42.52 9.59,42.52 | 81.98,6.1 v71.47,6.1
  Bottom 0.203: v12.18,42.52 20.26,42.52 21.48,41.3 ISP.6 | v71.47,6.1 71.47,3.81 H1.4
INT0  (via drill 0.51)
  Top 0.203: v51.96,20.27 50.13,20.27 MCU.32 | v68.72,24.84 69.79,23.77 69.79,23.16 RTC.3 | v59.27,30.94 56.68,30.94 49.52,38.1 36.72,38.1 MANUAL_LOG.2
  Bottom 0.203: 59.27,20.27 64.15,20.27 v68.72,24.84 | 59.27,20.27 v51.96,20.27 | 59.27,20.27 v59.27,30.94
LED+
  Top 0.203: R_LED.2 37.48,17.53 37.02,17.53 34.59,19.96 33.06,19.96 LED.A
N$1  (via drill 0.51)
  Top 0.203: v96.76,23.01 97.83,24.08 RX.C | v83.05,19.96 83.66,19.96 83.81,19.81 84.57,19.81 U1.22
  Bottom 0.203: v96.76,23.01 86.1,23.01 v83.05,19.96
N$2
  Top 0.203: U1.15 84.72,15.09 85.33,15.09 87.92,12.5 89.3,12.5 90.36,13.56 JP5.D+
N$3
  Top 0.203: U1.16 84.72,15.7 86.4,15.7 88.38,13.72 JP5.D-
N$4  (via drill 0.51)
  Top 0.203: v94.48,26.98 96.92,26.98 97.83,26.06 TX.C | v83.05,21.18 83.81,20.42 84.57,20.42 U1.23
  Bottom 0.203: v94.48,26.98 88.84,26.98 v83.05,21.18
N$5
  Top 0.203: RX.A 96.31,24.23 93.26,24.23 R_RXLED.2
N$6
  Top 0.203: TX.A 96.31,26.06 93.26,26.06 R_TXLED.2
N$7  (via drill 0.51)
  Top 0.203: 87.16,27.28 84.57,27.28 83.35,26.06 Q2.1 | 87.16,27.28 88.08,27.28 88.53,26.82 88.53,25.6 87.77,24.84 87.77,23.93 RSTAT.1 | v84.27,42.82 85.64,42.82 IC1.4 | 87.16,27.28 v87.16,27.58
  Bottom 0.203: v84.27,42.82 84.27,40.54 85.64,39.17 85.64,35.36 87.77,33.22 87.77,28.19 v87.16,27.58
N$8  (via drill 0.51)
  Top 0.203: v83.35,41.91 IC1.5 | v79.24,37.8 79.24,31.85 78.63,31.24 Q1.1
  Bottom 0.203: v79.24,37.8 v83.35,41.91
RESET  (via drill 0.51)
  Top 0.203: S2.4 13.4,42.82 13.4,37.8 S2.3 13.4,37.64 15.99,37.64 16.14,37.49 20.26,37.49 | 20.26,37.49 21.48,38.71 ISP.5 | 26.35,3.35 15.69,3.35 C_RESET.2 | 26.35,3.35 26.96,2.74 R_RESET.1 | v47.84,17.07 48.61,17.83 49.98,17.83 MCU.29 | 26.35,3.35 v28.34,3.35 | 20.26,37.49 20.26,18.59 24.68,14.17 28.79,14.17 v29.71,13.26
  Bottom 0.203: v47.84,17.07 35.96,5.18 30.16,5.18 29.71,4.72 | v28.34,3.35 29.71,4.72 | 29.71,4.72 v29.71,13.26
RX-I  (via drill 0.51)
  Top 0.203: v48.61,18.75 49.98,18.75 MCU.30 | v76.34,24.54 77.26,23.62 U1.1
  Bottom 0.203: v48.61,18.75 48.61,33.38 56.38,41.15 70.4,41.15 76.34,35.2 v76.34,24.54
SCL  (via drill 0.51)
  Top 0.203: v67.66,19.05 60.95,19.05 PU1.1 | v71.01,15.7 71.47,15.24 71.62,15.24 72.38,14.48 RTC.16 | v59.73,16.92 59.27,16.46 52.42,16.46 51.96,16.92 50.13,16.92 MCU.28
  Bottom 0.203: v71.01,15.7 69.79,16.92 | 69.79,16.92 v67.66,19.05 | 69.79,16.92 v59.73,16.92
SD_CLK
  Top 0.203: LSHIFT.2 32.3,26.21 32.3,26.82 31.54,27.58 28.79,27.58 26.96,25.76 26.35,25.76 SD.5
SD_CS  (via drill 0.51)
  Top 0.203: v37.48,22.55 37.48,26.06 LSHIFT.6 | v29.71,14.78 27.12,14.78 26.35,15.54 SD.1
  Bottom 0.203: v29.71,14.78 v37.48,22.55
SD_DI  (via drill 0.51)
  Top 0.203: v37.18,21.03 35.04,23.16 35.04,26.06 LSHIFT.4 | v34.43,18.29 26.35,18.29 SD.2
  Bottom 0.203: v34.43,18.29 v37.18,21.03
SDA
  Top 0.203: MCU.27 50.13,16.15 50.74,16.15 50.89,16 60.95,16 PU2.1 60.95,15.85 62.32,14.48 62.32,3.96 63.85,2.44 65.06,2.44 65.83,3.2 65.83,4.27 71.01,9.45 71.01,13.72 RTC.15
TX-O  (via drill 0.51)
  Top 0.203: v51.81,18.29 50.74,19.36 50.13,19.36 MCU.31 | v73.6,17.98 76.49,20.88 77.26,20.88 U1.5
  Bottom 0.203: v51.81,18.29 55.46,18.29 66.59,7.16 66.59,3.2 67.35,2.44 72.07,2.44 73.6,3.96 v73.6,17.98
VCC  (via drill 0.51)
  Top 0.203: LD0_SD.1 8.68,7.62 9.74,7.62 10.35,8.23 12.94,8.23 13.55,7.62 LD0_SENSE.1 13.71,7.62 14.32,7.62 v14.93,8.23 | IC1.6 85.79,41 86.25,41 86.71,41.45 86.71,42.67 87.77,43.74 91.12,43.74 91.43,43.43 91.43,42.06 90.52,41.15 DECOUP.1 90.52,41 90.52,38.86 94.17,35.2 94.17,30.94 89.6,26.36 COUT.1 | RSTAT.2 89.45,23.93 89.45,26.21 COUT.1 | 83.35,29.26 83.35,30.33 84.57,31.55 | 83.35,29.26 83.35,28.04 Q2.2 | 84.57,31.55 85.18,32.16 J1.PWR 84.57,31.55 | 83.35,29.26 78.63,29.26 Q1.2 | 84.57,31.55 89.45,26.67 89.45,26.36 COUT.1 | 46.02,22.4 45.71,22.71 44.8,22.71 44.64,22.55 44.64,21.79 MCU.6 | 46.02,22.4 46.02,21.79 MCU.4 | 60.04,19.81 60.04,18.44 60.19,18.29 60.34,18.29 PU2.2 | 60.04,19.81 60.95,20.73 PU1.2 60.95,20.88 68.57,20.88 | 46.02,22.4 46.32,22.71 57.14,22.71 60.04,19.81 | 68.57,20.88 69.64,20.88 71.01,22.25 71.01,23.01 RTC.2 | 26.96,5.79 26.96,5.94 L_LPF.1 26.96,5.79 | 26.96,5.79 26.96,4.42 R_RESET.2 27.12,4.27 28.95,4.27 31.69,1.52 65.52,1.52 66.44,2.44 | 66.44,2.44 67.81,3.81 H1.3 | H1.8 83.96,3.81 82.59,2.44 66.44,2.44 | v68.57,15.7 68.57,20.88 | 26.96,5.79 v25.75,7.01
  Bottom 0.203: ISP.2 16.45,41.15 14.93,39.62 v14.93,8.23 24.53,8.23 v25.75,7.01 | v68.57,15.7 68.57,4.42 H1.3 | J1.PWR 85.18,32.16 85.18,24.54 82.13,21.49 82.13,7.01 85.33,3.81 H1.8
VDD  (via drill 0.51)
  Top 0.203: 12.03,4.72 12.03,5.18 12.18,5.33 12.18,6.55 11.27,7.47 LD0_SD.5 | 12.03,4.72 12.03,2.74 11.12,1.83 C_LDO_SD.2 | 27.27,23.47 26.96,23.16 26.35,23.16 SD.4 27.27,23.47 | 27.27,23.47 29.86,26.06 31.08,26.06 LSHIFT.1 | v11.57,4.72 12.03,4.72 | 27.27,23.47 v28.79,21.95
  Bottom 0.203: v11.57,4.72 24.68,4.72 28.79,8.84 v28.79,21.95
VUSB  (via drill 0.51)
  Top 0.203: R_TXLED.1 91.58,25.91 91.58,24.23 R_RXLED.1 91.43,24.08 91.43,21.95 91.12,21.64 91.12,17.22 91.73,16.61 91.73,15.7 90.97,14.94 89.75,14.94 88.53,16.15 JP5.VBUS | USBD0.1 74.51,28.65 73.6,28.65 71.62,26.67 USBD1.A 71.47,26.67 76.34,21.79 77.26,21.79 U1.4 77.41,21.64 78.02,21.64 81.07,18.59 | 81.07,18.59 81.22,18.44 v83.05,18.44 84.57,18.44 U1.20 | 81.07,18.59 81.07,26.98 Q2.3
  Bottom 0.203: v83.05,18.44 85.18,16.31 88.38,16.31 JP5.VBUS
X0
  Top 0.203: 43.58,25.6 43.58,21.79 MCU.7 | 43.58,25.6 43.58,29.41 CX0.2 | 43.58,25.6 51.96,25.6 XTAL.2
X1  (via drill 0.51)
  Top 0.203: 42.66,30.18 43.58,31.09 43.58,31.39 CX1.2 | 42.66,30.18 42.66,21.95 42.81,21.79 MCU.8 | v45.1,33.22 47.84,30.48 51.96,30.48 XTAL.1 | 42.66,30.18 v42.36,30.48
  Bottom 0.203: v42.36,30.48 v45.1,33.22

### Text on the board
tPlace: 1 | 3V3 | A7 | 3V3 | A6 | 05 June 2013 | Andy Wickert | Northern Widget LLC | Bottle / Logger / 1.0.0 | Saint Paul, MN | TM | 1 | v. 1.0.0, rev. 2 / (Added a Pin 1 marker / to LTC4412) | A0 | 3V3 | A1 | 3V3 | A2 | 3V3 | A3 | 3V3 | D3-INT1 | GND | VCC | GND | D6 | D7 | GND | VCC | TM